# Altium schematic sheet 11.SchDoc
size 297 x 209 mm
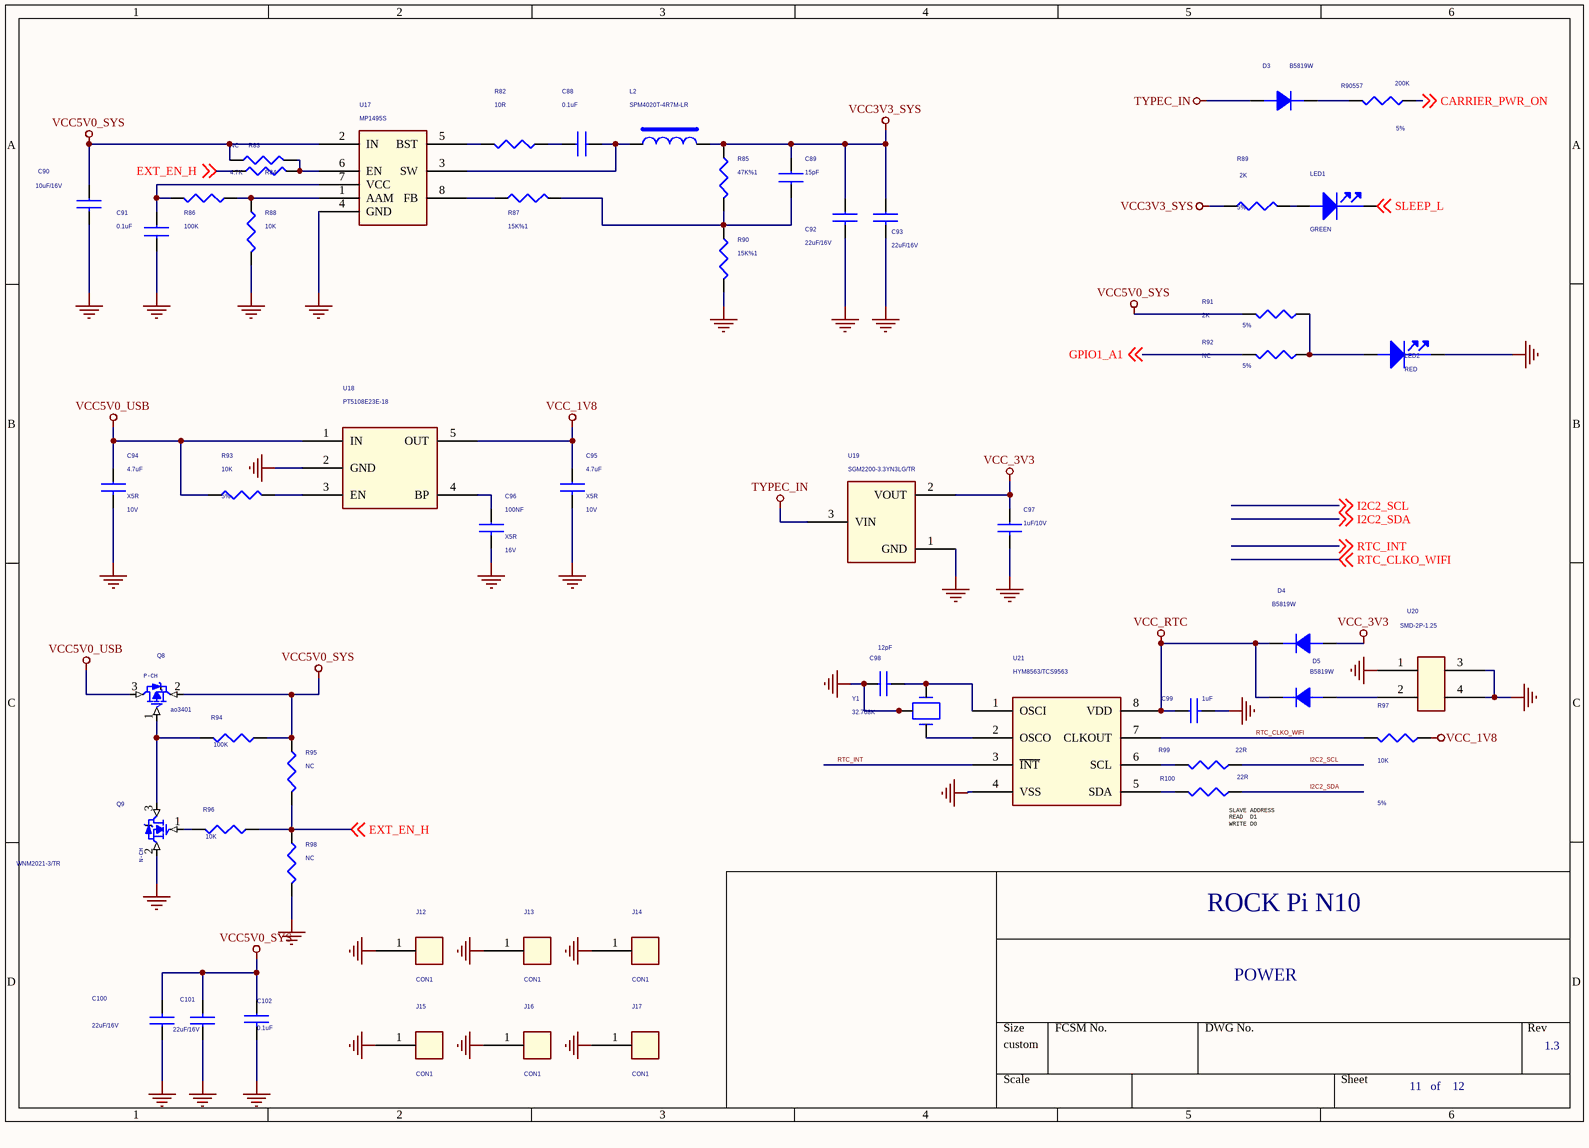
[diagram p0: 11.SchDoc]

## Parts
C88  0.1uF  [C0603]
C89  15pF  [C0603]
C90  10uF/16V  [C0603]
C91  0.1uF  [C0603]
C92  22uF/16V  [C0805]
C93  22uF/16V  [C0805]
C94  4.7uF  Dielectric: X5R  Voltage: 10V  [C0603]
C95  4.7uF  Dielectric: X5R  Voltage: 10V  [C0603]
C96  100NF  Dielectric: X5R  Voltage: 16V  [C0402]
C97  1uF/10V  [C0402]
C98  12pF  [C0402]
C99  1uF  [C0402]
C100  22uF/16V  [C0805]
C101  22uF/16V  [C0805]
C102  0.1uF  [C0402]
D3  B5819W  [SOD_123]
D4  B5819W  [SOD_123]
D5  B5819W  [SOD_123]
J12  CON1  [H3.8MM]
J13  CON1  [H3.8MM]
J14  CON1  [H3.8MM]
J15  CON1  [H3.8MM]
J16  CON1  [H2.8MM]
J17  CON1  [H2.8MM]
L2  SPM4020T-4R7M-LR  [IND-4X4]
LED1  GREEN  [LED0603]
LED2  RED  [LED0603]
Q8  ao3401  [S0T-23]
Q9  WNM2021-3/TR  [S0T-23]
R82  10R  [R0402]
R83  NC  [R0402]
R84  4.7K  [R0402]
R85  47K%1  [R0402]
R86  100K  [R0402]
R87  15K%1  [R0402]
R88  10K  [R0402]
R89  2K  Tolerance: 5%  [R0402]
R90  15K%1  [R0402]
R91  2K  Tolerance: 5%  [R0402]
R92  NC  Tolerance: 5%  [R0402]
R93  10K  Tolerance: 5%  [R0402]
R94  100K  [R0402]
R95  NC  [R0402]
R96  10K  [R0402]
R97  10K  Tolerance: 5%  [R0402]
R98  NC  [R0402]
R99  22R  [R0402]
R100  22R  [R0402]
R90557  200K  Tolerance: 5%  [R0402]
U17  MP1495S  [TSOT_23_8]
U18  PT5108E23E-18  [SOT25]
U19  SGM2200-3.3YN3LG/TR  [SOT23]
U20  SMD-2P-1.25  [SMD-2P-1.25]
U21  HYM8563/TCS9563  [MSOP8]
Y1  32.768K  [CRY-MC146]

## Nets
GND: C90.2 C91.1 C92.2 C93.2 C94.2 C95.2 C96.2 C97.2 C98.1 C99.2 C100.1 C101.1 C102.2 J12.1 J13.1 J14.1 J15.1 J16.1 J17.1 LED2.2(CATHODE) Q9.2(S) R88.2 R90.2 R98.2 U17.4(GND) U18.2(GND) U19.1(GND) U20.1 U20.3 U20.4 U21.4(VSS) Y1.3 Y1.4
TYPEC_IN: D3.1(A) U19.3(VIN)
VCC3V3_SYS: C89.2 C92.1 C93.1 L2.2 R85.1 R89.1
VCC5V0_SYS: C90.1 C100.2 C101.2 C102.1 Q8.2(S) R83.2 R91.1 R94.2 R95.1 U17.2(IN)
VCC5V0_USB: C94.1 Q8.3(D) R93.1 U18.1(IN)
VCC_1V8: C95.1 R97.2 U18.5(OUT)
VCC_3V3: C97.1 D4.1(A) U19.2(VOUT)
VCC_RTC: C99.1 D4.2(K) D5.2(K) U21.8(VDD)
CARRIER_PWR_ON: R90557.2 ; off-sheet CARRIER_PWR_ON
EXT_EN_H: R84.2 R95.2 R96.2 R98.1 ; off-sheet EXT_EN_H
GPIO1_A1: R92.1 ; off-sheet GPIO1_A1
I2C2_SCL: R99.2 ; off-sheet I2C2_SCL
I2C2_SDA: R100.2 ; off-sheet I2C2_SDA
RTC_CLKO_WIFI: R97.1 U21.7(CLKOUT) ; off-sheet RTC_CLKO_WIFI
RTC_INT: U21.3(~{INT}) ; off-sheet RTC_INT
SLEEP_L: LED1.2(CATHODE) ; off-sheet SLEEP_L
NetC88_1: C88.1 L2.1 U17.3(SW)
NetC88_2: C88.2 R82.1
NetC89_1: C89.1 R85.2 R87.2 R90.1
NetC91_2: C91.2 R86.2 U17.7(VCC)
NetC96_1: C96.1 U18.4(BP)
NetC98_2: C98.2 U21.1(OSCI) Y1.1
NetD3_2: D3.2(K) R90557.1
NetD5_1: D5.1(A) U20.2
NetLED1_1: LED1.1(ANODE) R89.2
NetLED2_1: LED2.1(ANODE) R91.2 R92.2
NetQ8_1: Q8.1(G) Q9.3(D) R94.1
NetQ9_1: Q9.1(G) R96.1
NetR82_2: R82.2 U17.5(BST)
NetR83_1: R83.1 R84.1 U17.6(EN)
NetR86_1: R86.1 R88.1 U17.1(AAM)
NetR87_1: R87.1 U17.8(FB)
NetR93_2: R93.2 U18.3(EN)
NetR99_1: R99.1 U21.6(SCL)
NetR100_1: R100.1 U21.5(SDA)
NetU21_2: U21.2(OSCO) Y1.2

## Notes on the sheet
- (near R100) SLAVE ADDRESS
  READ  D1
  WRITE D0
- ROCK Pi N10
- POWER
- 1.3
- 11   of    12
- (in symbol N-MOSFET) N-CH
- (in symbol P-MOSFET) P-CH

## Library data of the parts
C88 C89 C91 = CAP NP_Dup3: RoHS CHIP CAP 1uF +10/-10% 16V X5R
C90 C92 C93 = CAP NP_2_Dup1: ROOM: CHG
C94 = CAP NP_2: cap,4.70uF,+/-10%,10V,X5R,C0603; Manufacturer PN: C1608X5R1A475K080AC; Manufacturer: TDK; Tolerance: 10%; Priority: A; Created by: JJJ; Part Type: C0603; RK PN: C1608X5R1A475K080AC
C95 = CAP NP_2: cap,4.70uF,+/-10%,10V,X5R,C0603; Manufacturer: TDK; RK PN: C1608X5R1A475K080AC; Priority: A; Tolerance: 10%; Part Type: C0603; Manufacturer PN: C1608X5R1A475K080AC; Created by: JJJ
C96 = CAP NP_2: cap,100.00nF,+/-10%,16V,X5R,C0402; Manufacturer PN: C1005X5R1C104K050BA; Manufacturer: TDK; Tolerance: 10%; Priority: A; Created by: JJJ; Part Type: C0402; RK PN: C1005X5R1C104K050BA
C97 = CAP NP_Dup1: RoHS CHIP CAP 1uF +10/-10% X5R
C98 = CAP NP_Dup1: CAP,MLCC,8pF,+/-0.5pF,NPO,6.3V,SMD0402
C99 = CAP NP_Dup2: RoHS CHIP CAP 1uF +10/-10% X5R; BOM_VALUE: 1000000; BOM_TYPE: 30
C100 C101 = CAP NP_4
C102 = CAP NP_Dup1: CAP,MLCC,1nF,+/-10%,X5R,6.3V,SMD0402; MARK: 22P; ROOM: USB+5V
D3-D5 = DIODE: Schottky Barrier，B5819W SOD-123; Manufacturer: 长电; Priority: A; ROOM: CHG; Created by: JJJ; Manufacturer PN: B5819W; Part Type: Schottky rectifier; RK PN: B5819W
L2 = INDUCTORS OF FERRITE_Dup1
LED1 = LED_0
LED2 = LED: 贴片LED灯，0603，绿色; RK PN: LED_GREEN; Priority: A; Part Type: LED; Created by: JJJ
Q8 = P-MOSFET: SANZ_P/N: SK2301; Part Type: MOS管
Q9 = N-MOSFET: SANZ_P/N: SK2300; Part Type: MOS管
R82-R88 R90 R95 R98 = RESISTOR_0: RES,thick film,47KOhm,+/-5%,1/16W,SMD0402; MARK: 51K
R89 = RESISTOR_3: 通用厚膜电阻,10K,+/-5%,R0402,1/16W.; Manufacturer PN: RC0402JR-0710KL; Manufacturer: YAGEO; Wattage: 1/16W; Priority: A; Created by: YTL; Part Type: 通用厚膜电阻; RK PN: RC0402JR-0710KL
R91 R92 R90557 = RESISTOR_3: 通用厚膜电阻,330R,+/-5%,R0402,1/16W.; Manufacturer: YAGEO; RK PN: RC0402JR-07330RL; Priority: A; Wattage: 1/16W; Part Type: 通用厚膜电阻; Manufacturer PN: RC0402JR-07330RL; Created by: YTL
R93 = RESISTOR_3: 通用厚膜电阻,10K,+/-5%,R0402,1/16W.; Manufacturer: YAGEO; RK PN: RC0402JR-0710KL; Priority: A; Wattage: 1/16W; Part Type: 通用厚膜电阻; Manufacturer PN: RC0402JR-0710KL; Created by: YTL
R94 R96 = RESISTOR_1: RES,thick film,47KOhm,+/-5%,1/16W,SMD0402
R97 = RESISTOR_3: 通用厚膜电阻,5K1,+/-5%,R0402,1/16W.; Manufacturer: YAGEO; RK PN: RC0402JR-075K1L; Priority: A; Wattage: 1/16W; Part Type: 通用厚膜电阻; Manufacturer PN: RC0402JR-075K1L; Created by: YTL
R99 = RESISTOR_3: 通用厚膜电阻,5K1,+/-5%,R0402,1/16W.; Manufacturer PN: RC0402JR-075K1L; Manufacturer: YAGEO; Tolerance: 5%; Wattage: 1/16W; Priority: A; Created by: YTL; Part Type: 通用厚膜电阻; RK PN: RC0402JR-075K1L
R100 = RESISTOR_3: 通用厚膜电阻,5K1,+/-5%,R0402,1/16W.; Manufacturer: YAGEO; Tolerance: 5%; RK PN: RC0402JR-075K1L; Priority: A; Wattage: 1/16W; Part Type: 通用厚膜电阻; Manufacturer PN: RC0402JR-075K1L; Created by: YTL
U17 = BUCK-MP1495
U18 = LDO_PT5108: 500mA, Low Dropout, Low Noise Ultra-Fast Without Bypass Capacitor CMOS LDO Regulator; Manufacturer: Richtek（立錡）; Manufacturer PN: RT9013-30GB; Option: /CE75B30M; RK PN: RT9013-30B; Priority: A; Part Type: LDO; Created by: JJJ
U19 = CE71XXMM: High voltage LDO,CE7521MMR,50mA,2.1V output,-0.3V~18V input,SOT23,-40°C~ +85  °C
U20 = CON3_6
U21 = LM4990_1: RTC IC,CMOS RTC/Calendar,1.0V~5.5V,TSSOP8,-40 ~85℃; BOM_TYPE: 10; BOM_VALUE: 8
Y1 = CRYSTAL_2: OSC,32.768KHz,+/-25ppm,3.3V,12pF,MC146,-20℃~70℃; BOM_VALUE: 0; BOM_TYPE: 62